# Altium schematic sheet Scheamtic.schdoc
size 299 x 177 mm
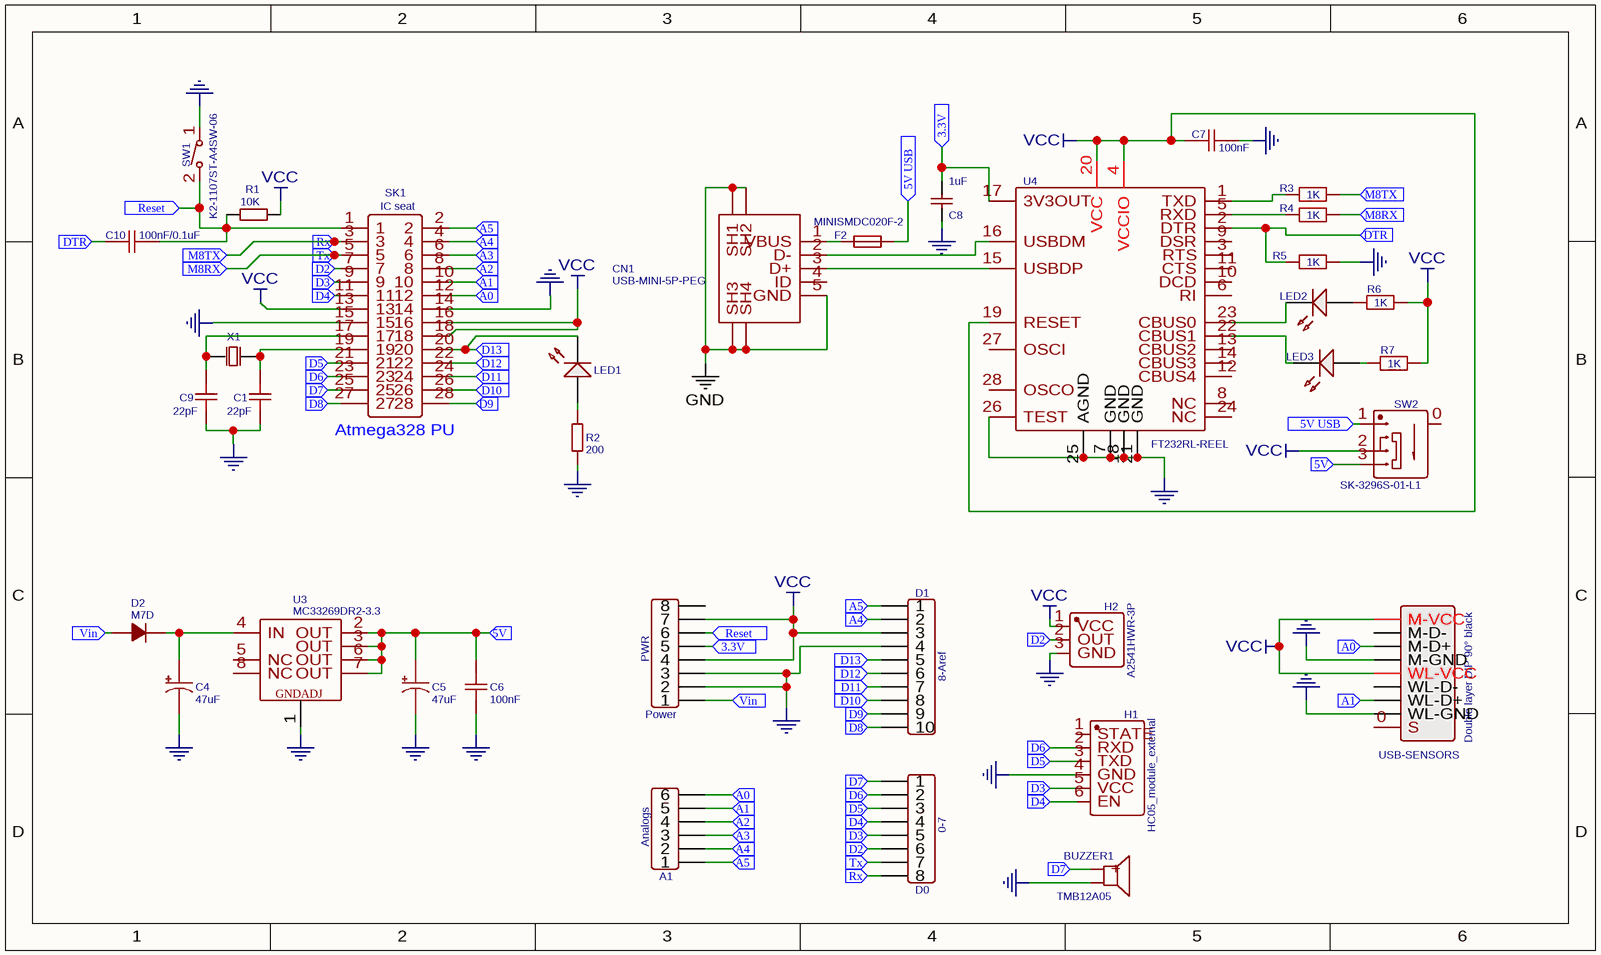
[diagram p0: Scheamtic.schdoc]

## Parts
A1  Analogs  [HDR-6X1/2.54]
BUZZER1  TMB12A05  [B-12*7.5]
C1  22pF  [0805]
C4  47uF  [CAP-SMD_BD8.0-L8.3-W8.3-FD]
C5  47uF  [CAP-SMD_BD8.0-L8.3-W8.3-FD]
C6  100nF  [0805]
C7  100nF  [0805]
C8  1uF  [0805]
C9  22pF  [0805]
C10  100nF/0.1uF  [0402]
CN1  USB-MINI-5P-PEG  [MINI-USB-B-SMD_5PIN-FEMALE_MINI-5P-PEG]
D0  0-7  [HDR-8X1/2.54]
D1  8-Aref  [HDR-10X1/2.54]
D2  M7D  [SMA_L4.4-W2.6-LS5.0-RD]
F2  MINISMDC020F-2  [1812]
H1  HC05_module_external  [HDR-TH_6P-P2.54-H-W8.6_A2541HWR-6P]
H2  A2541HWR-3P  [A2541HWR-3P]
LED1  17-21/GHC-YR1S2/3T  [LED-0805]  (value not drawn)
LED2  17-21/GHC-YR1S2/3T  [LED-0805]  (value not drawn)
LED3  17-21/GHC-YR1S2/3T  [LED-0805]  (value not drawn)
PWR  Power  [HDR-8X1/2.54]
R1  10K  [0805]
R2  200  [0805]
R3  1K  [R0603]
R4  1K  [R0603]
R5  1K  [R0603]
R6  1K  [R0603]
R7  1K  [R0603]
SK1  IC seat  [DIP-28_L36.0-W10.2-P2.54-LS10.2-BL]
SW1  K2-1107ST-A4SW-06  [K2-1107ST-A4SW-06]
SW2  SK-3296S-01-L1  [SW-SMD-C8.4X4.3]
U3  MC33269DR2-3.3  [SOIC-8_150MIL]
U4  FT232RL-REEL  [SSOP-28_L10.2-W5.3-P0.65-LS7.8-BL]
USB-SENSORS  Double layer DIP 90° black  [USB-M-51]
X1  16MHZ  [OSC-49S-1]  (value not drawn)

## Ports
3.3V, 5V, 5V USB, A0, A1, A2, A3, A4, A5, D2, D3, D4, D5, D6, D7, D8, D9, D10, D11, D12, D13, DTR, M8RX, M8TX, Reset, Rx, Tx, Vin

## Nets
GND: BUZZER1.2 C1.1 C4.2 C5.2 C6.2 C7.1 C8.1 C9.1 CN1.5(GND) CN1.SH1 CN1.SH2 CN1.SH3 CN1.SH4 D1.4 H1.4(GND) H2.3(GND) PWR.2 PWR.3 R2.1 R5.2 SK1.14 SK1.15 SW1.1 U3.1(GNDADJ) U4.7(GND) U4.18(GND) U4.21(GND) U4.25(AGND) U4.26(TEST) USB-SENSORS.4(M-GND) USB-SENSORS.8(WL-GND)
VCC: C7.2 D1.3 H2.1(VCC) PWR.4 PWR.7 R1.1 R6.2 R7.2 SK1.13 SK1.16 SK1.18 SW2.2 U4.4(VCCIO) U4.19(RESET) U4.20(VCC) USB-SENSORS.1(M-VCC) USB-SENSORS.5(WL-VCC)
3.3V: C8.2 PWR.5 U4.17(3V3OUT) ; port 3.3V
5V: C5.1 C6.1 SW2.3 U3.2(OUT) U3.3(OUT) U3.6(OUT) U3.7(OUT) ; port 5V
5V USB: F2.2 SW2.1 ; port 5V USB
A0: A1.6 SK1.12 USB-SENSORS.3(M-D+) ; port A0
A1: A1.5 SK1.10 USB-SENSORS.7(WL-D+) ; port A1
A2: A1.4 SK1.8 ; port A2
A3: A1.3 SK1.6 ; port A3
A4: A1.2 D1.2 SK1.4 ; port A4
A5: A1.1 D1.1 SK1.2 ; port A5
D2: D0.6 H2.2(OUT) SK1.7 ; port D2
D3: D0.5 H1.5(VCC) SK1.9 ; port D3
D4: D0.4 H1.6(EN) SK1.11 ; port D4
D5: D0.3 H1.3(TXD) SK1.21 ; port D5
D6: D0.2 H1.2(RXD) SK1.23 ; port D6
D7: BUZZER1.1(+) D0.1 SK1.25 ; port D7
D8: D1.10 SK1.27 ; port D8
D9: D1.9 SK1.28 ; port D9
D10: D1.8 SK1.26 ; port D10
D11: D1.7 SK1.24 ; port D11
D12: D1.6 SK1.22 ; port D12
D13: D1.5 LED1.2(C) SK1.20 ; port D13
DTR: C10.1 R5.1 U4.2(DTR) ; port DTR
M8RX: D0.7 R4.2 SK1.5 ; port Tx, port M8RX
M8TX: D0.8 R3.2 SK1.3 ; port Rx, port M8TX
Reset: C10.2 PWR.6 R1.2 SK1.1 SW1.2 ; port Reset
Vin: D2.2(A) PWR.1 ; port Vin
NetC1_2: C1.2 SK1.19 X1.1(OSC1)
NetC4_1: C4.1 D2.1(C) U3.4(IN)
NetC9_2: C9.2 SK1.17 X1.2(OSC2)
NetCN1_1: CN1.1(VBUS) F2.1
NetCN1_2: CN1.2(D-) U4.16(USBDM)
NetCN1_3: CN1.3(D+) U4.15(USBDP)
NetLED1_1: LED1.1(A) R2.2
NetLED2_1: LED2.1(A) R6.1
NetLED2_2: LED2.2(C) U4.23(CBUS0)
NetLED3_1: LED3.1(A) R7.1
NetLED3_2: LED3.2(C) U4.22(CBUS1)
NetR3_1: R3.1 U4.1(TXD)
NetR4_1: R4.1 U4.5(RXD)

Not connected (* = marked no-connect by the designer): CN1 4(ID); H1 1(STATE); PWR 8; SW2 0; U3 5(NC) 8(NC); U4 3(RTS) 6(RI) 8(NC) 9(DSR) 10(DCD) 11(CTS) 12(CBUS4) 13(CBUS2) 14(CBUS3) 24(NC) 27(OSCI) 28(OSCO); USB-SENSORS 0(S) 2(M-D-) 6(WL-D-)

## Notes on the sheet
- (near SK1) Atmega328 PU

## Library data of the parts
A1 = Analogs: BOM_Manufacturer: BOOMELE; BOM_Manufacturer Part: Header-Male-2.54_1x6; BOM_Supplier: LCSC; spicePre: P; BOM_Supplier Part: C37208
BUZZER1 = TMB12A05: BOM_Manufacturer: HNDZ; BOM_Supplier: LCSC; BOM_Manufacturer Part: TMB12A05; BOM_Supplier Part: C96093; spicePre: B
C1 C9 = 22pF: BOM_Manufacturer: FH; BOM_Manufacturer Part: 0805CG220J500NT; nameAlias: Capacitance; BOM_Supplier: LCSC; BOM_Supplier Part: C24658; spicePre: C; spiceSymbolName: 0805CG220J500NT
C4 C5 = 47uF: BOM_Manufacturer: PANASONIC; BOM_Manufacturer Part: EEEHD1E470AP; nameAlias: Capacitance; Contributor: LCSC; BOM_Supplier: LCSC; BOM_Supplier Part: C401849; spicePre: C; spiceSymbolName: EEEHD1E470AP
C6 C7 = 100nF: BOM_Manufacturer: YAGEO; BOM_Manufacturer Part: AC0805KRX7R9BB104; nameAlias: Capacitance; Contributor: LCSC; BOM_Supplier: LCSC; BOM_Supplier Part: C277502; spicePre: C; spiceSymbolName: AC0805KRX7R9BB104
C8 = 1uF: BOM_Manufacturer: YAGEO; BOM_Manufacturer Part: CC0805ZKY5V9BB105; nameAlias: Capacitance; BOM_Supplier: LCSC; BOM_Supplier Part: C106838; spicePre: C; spiceSymbolName: CC0805ZKY5V9BB105
C10 = 100nF/0.1uF: BOM_Manufacturer: MuRata; BOM_Manufacturer Part: GRM155R71C104KA88D; nameAlias: Capacitance; BOM_Supplier: LCSC; BOM_Supplier Part: C71629; spicePre: C; spiceSymbolName: GRM155R71C104KA88D
CN1 = USB-MINI-5P-PEG: BOM_Manufacturer: ValuePro; BOM_Supplier: LCSC; BOM_Manufacturer Part: USB-MINI-5P-PEG; image: //image.lceda.cn/szlcsc/C69074.jpg; BOM_Supplier Part: C69074; spicePre: C
D0 = 0-7: BOM_Manufacturer: ReliaPro; BOM_Manufacturer Part: Header2.54mm 1*8P; BOM_Supplier: LCSC; image: http://image.lceda.cn/szlcsc/C49256.jpg; spicePre: P
D1 = 8-Aref: BOM_Manufacturer: ReliaPro; BOM_Manufacturer Part: Headers??Pins2.54mm1*10P; BOM_Supplier: LCSC; image: http://image.lceda.cn/szlcsc/C57369.jpg; spicePre: P
D2 = M7D: BOM_Manufacturer: SEMTECH; SMT Type: Extend; BOM_Supplier: LCSC; BOM_Manufacturer Part: M7D; BOM_Supplier Part: C83913; BOM_LCSC Assembly: Yes; spicePre: D
F2 = MINISMDC020F-2: BOM_Manufacturer: Littelfuse; Contributor: LCSC; BOM_Supplier: LCSC; BOM_Supplier Part: C5418; BOM_Manufacturer Part: MINISMDC020F-2; spicePre: F
H1 = HC05_module_external: BOM_Manufacturer: Changjiang Connectors; BOM_Manufacturer Part: A2541HWR-6P; Contributor: LCSC; BOM_Supplier: LCSC; BOM_Supplier Part: C225514; spicePre: H
H2 = A2541HWR-3P: BOM_Manufacturer: Changjiang Connectors; Contributor: LCSC; BOM_Supplier: LCSC; BOM_Supplier Part: C225511; BOM_Manufacturer Part: A2541HWR-3P; spicePre: H
LED1-LED3 = 17-21/GHC-YR1S2/3T: BOM_Manufacturer: EVERLIGHT; BOM_Supplier: EasyEDA; BOM_Manufacturer Part: 17-21/GHC-YR1S2/3T; spicePre: L; BOM_Supplier Part: E73546
PWR = Power: BOM_Manufacturer: ReliaPro; BOM_Manufacturer Part: Header2.54mm 1*8P; BOM_Supplier: LCSC; image: http://image.lceda.cn/szlcsc/C49256.jpg; spicePre: P
R1 = 10K: BOM_Manufacturer: UniOhm; BOM_Manufacturer Part: 0805W8F1002T5E; nameAlias: Resistance (Ohms); SMT Type: Basic; BOM_Supplier: LCSC; BOM_LCSC Assembly: Yes; BOM_Supplier Part: C17414; spicePre: R; spiceSymbolName: 0805W8F1002T5E
R2 = 200: BOM_Manufacturer: Viking Tech; BOM_Manufacturer Part: ARG05FTC2000; nameAlias: Resistance (Ohms); Contributor: LCSC; BOM_Supplier: LCSC; BOM_Supplier Part: C218416; spicePre: R; spiceSymbolName: ARG05FTC2000
R3-R7 = 1K: BOM_Manufacturer: Walsin Tech Corp; BOM_Manufacturer Part: WR06X102 JTL; nameAlias: Resistance (Ohms); Contributor: LCSC; BOM_Supplier: LCSC; BOM_Supplier Part: C384295; spicePre: R; spiceSymbolName: WR06X102 JTL
SK1 = IC seat: BOM_Manufacturer: Boom Precision Elec; Contributor: LCSC; BOM_Supplier: LCSC; BOM_Supplier Part: C16653; BOM_Manufacturer Part: -; spicePre: S
SW1 = K2-1107ST-A4SW-06: BOM_Manufacturer: Rectangular Connectors - Contacts; Contributor: LCSC; BOM_Supplier: LCSC; BOM_Supplier Part: C118141; BOM_Manufacturer Part: K2-1107ST-A4SW-06; spicePre: S
SW2 = SK-3296S-01-L1: BOM_Manufacturer: XKB Enterprise; Contributor: LCSC; BOM_Supplier: LCSC; BOM_Supplier Part: C319020; BOM_Manufacturer Part: SK-3296S-01-L1; spicePre: S
U3 = MC33269DR2-3.3: BOM_Manufacturer: ON; BOM_Supplier: LCSC; BOM_Manufacturer Part: MC33269DR2-3.3; image: //image.lceda.cn/szlcsc/C7301.jpg; spicePre: U; BOM_Supplier Part: C7301
U4 = FT232RL-REEL: BOM_Manufacturer: FTDI; SMT Type: Basic; BOM_Supplier: LCSC; BOM_Manufacturer Part: FT232RL-REEL; BOM_LCSC Assembly: Yes; image: //image.lceda.cn/szlcsc/C8690.jpg; BOM_Supplier Part: C8690; spicePre: U
USB-SENSORS = Double layer DIP 90° black: BOM_Manufacturer: ValuePro; BOM_Supplier: LCSC; BOM_Manufacturer Part: Double layer DIP 90° black; image: //image.lceda.cn/szlcsc/C12049.jpg; BOM_Supplier Part: C12049; spicePre: U
X1 = 16MHZ: BOM_Manufacturer: YXC; BOM_Manufacturer Part: X49SD16MSD2SC; Value: 16MHZ; BOM_Supplier: LCSC; spicePre: X; BOM_Supplier Part: C16212